# Altium schematic sheet 1_P1.schdoc
size 429 x 307 mm; Symbol: Sheet-Symbol_B; Device: Sheet-Symbol_B; @Project Name: INS Nav0; @Page Count: 1; @Update Date: 2026-06-21; @Create Date: 2026-06-21; @Schematic Name: Schematic1; @Page No: 1; @Page Name: P1; Company: EasyEDA.com; Version: V1.0; Page Size: B; @Create Time: 07:02:29; @Update Time: 11:43:39; @Board Name: Board1; Width: 1655; Height: 1170; Region Start: 1; X Region Count: 6; Y Region Count: 4; Blade Width: 10; Color: #000066; Title Block Position: 3
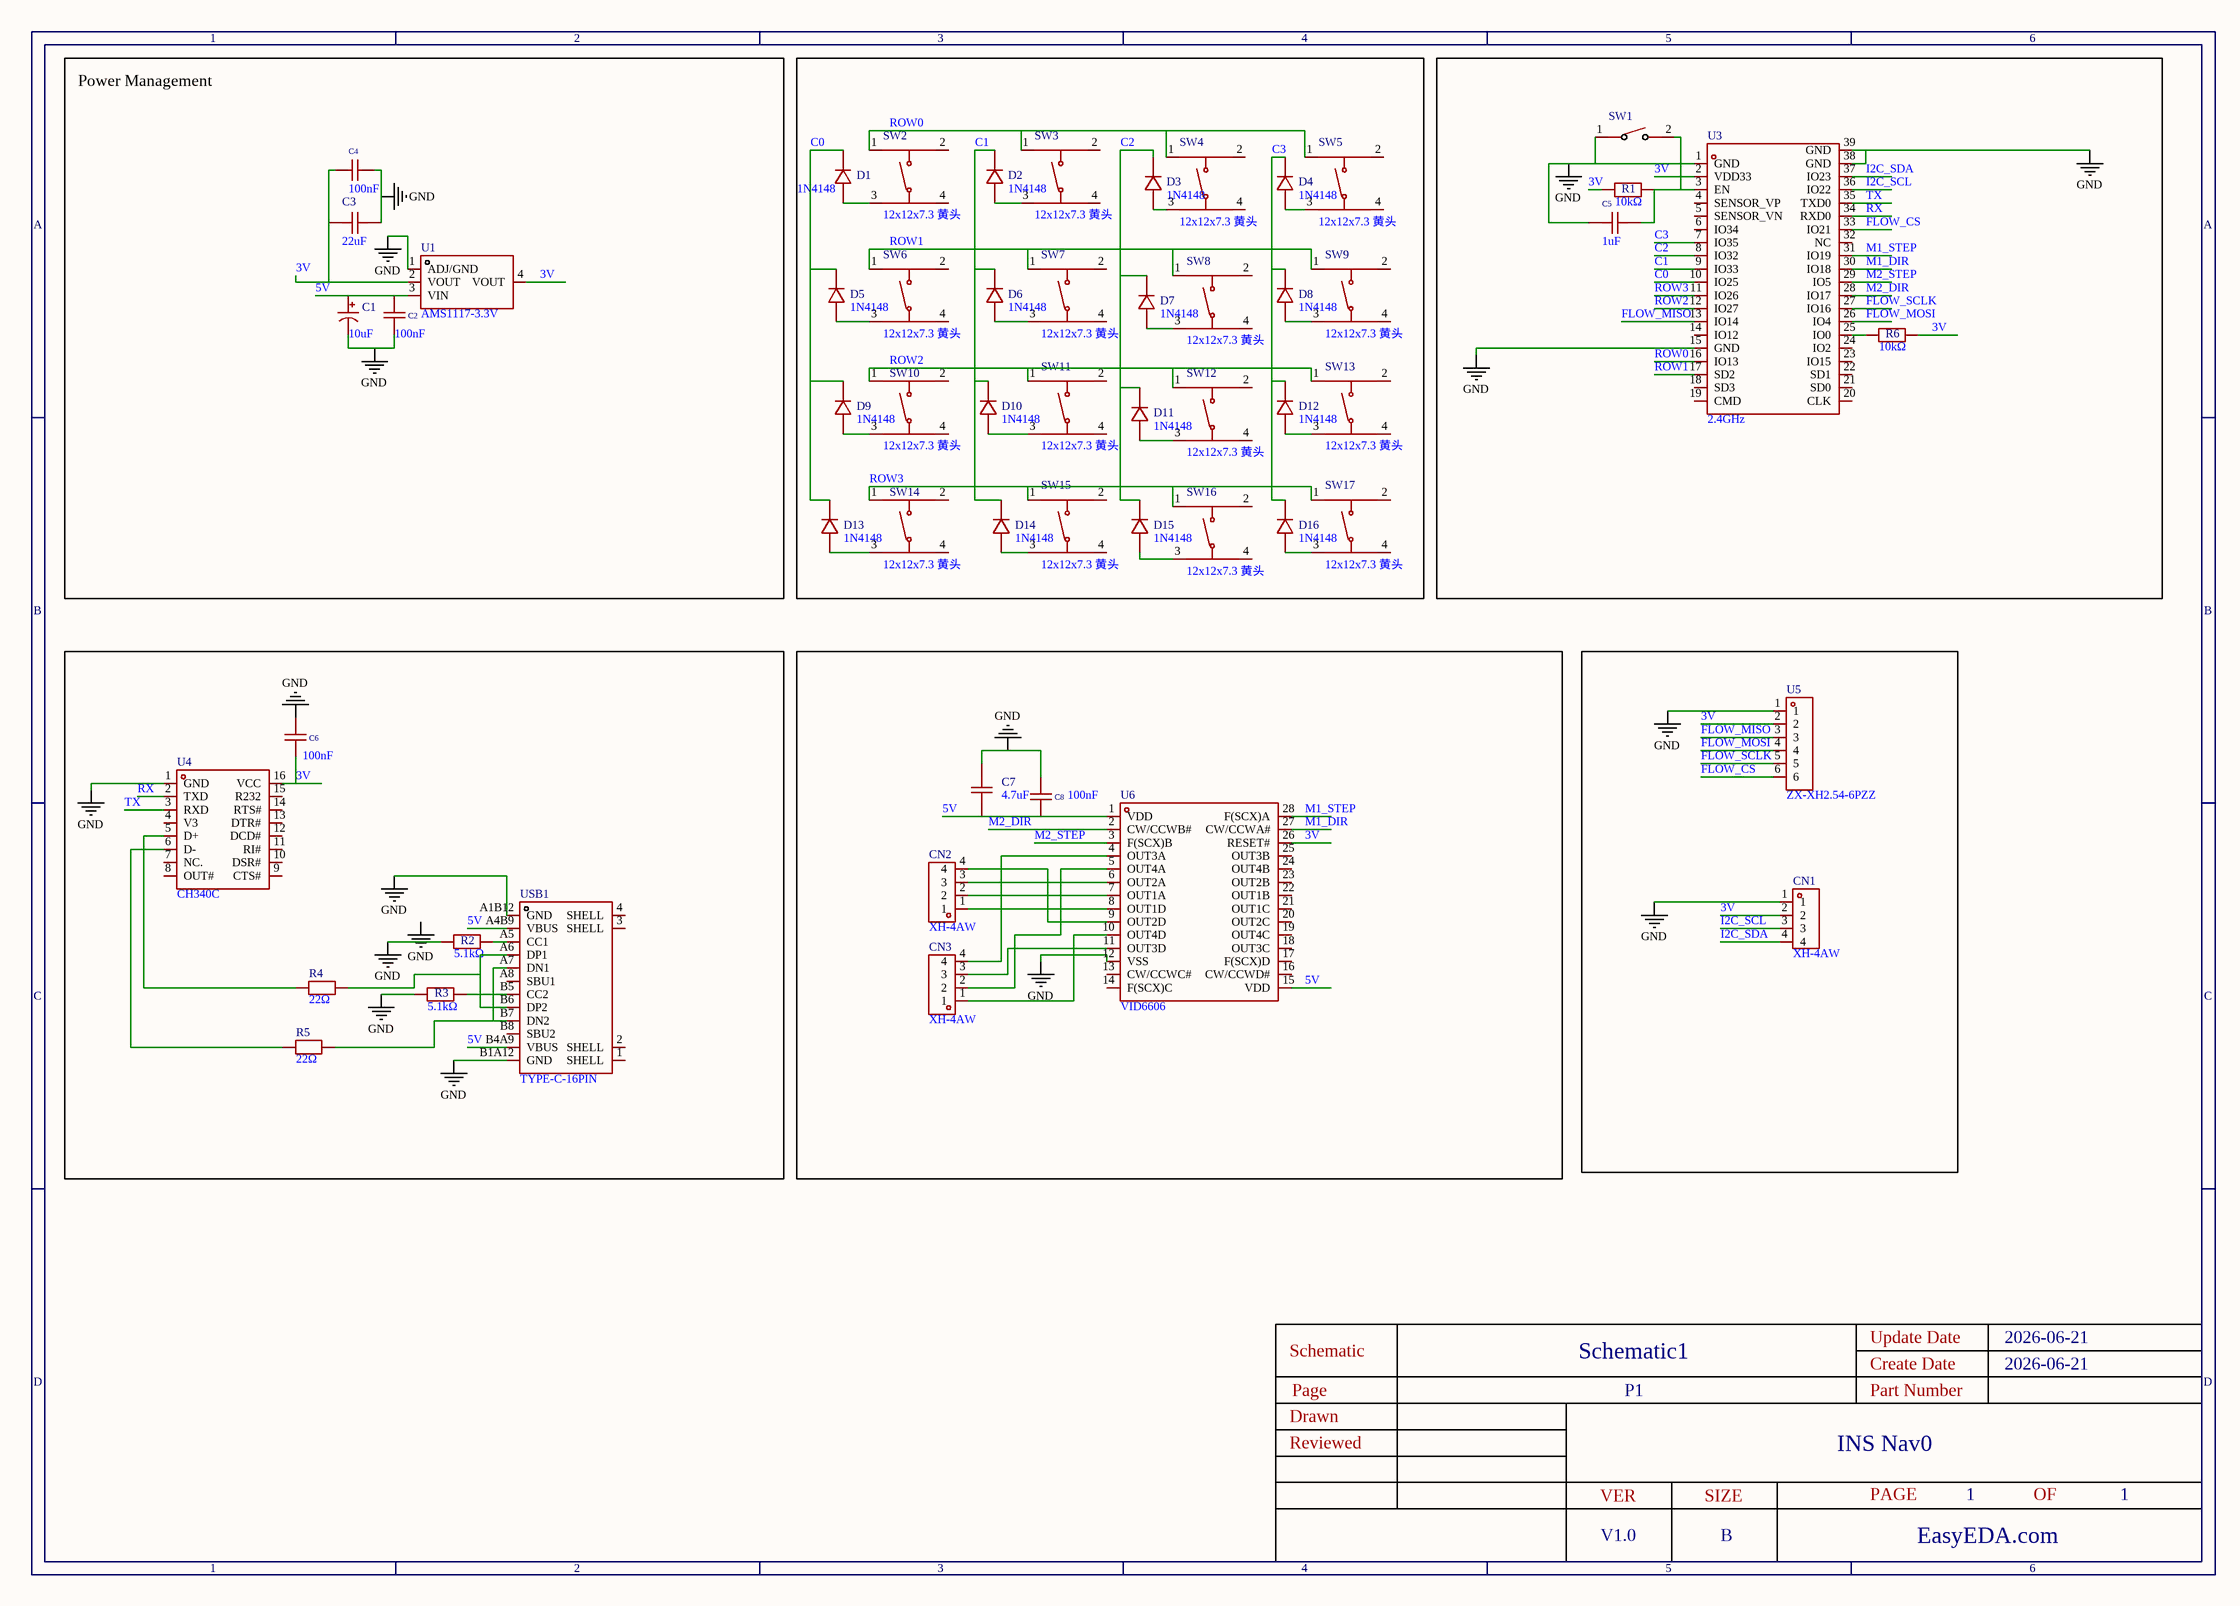
[diagram p0: 1_P1.schdoc]

## Parts
C1  10uF  [CAP-TH_BD4.0-P1.50-D0.8-FD]
C2  100nF  [C0402]
C3  22uF  [C0603]
C4  100nF  [C0402]
C5  1uF  [C0603]
C6  100nF  [C0402]
C7  4.7uF  [C0402]
C8  100nF  [C0402]
CN1  XH-4AW  [CONN-TH_XH-4AW]
CN2  XH-4AW  [CONN-TH_XH-4AW]
CN3  XH-4AW  [CONN-TH_XH-4AW]
D1  1N4148  [DO-35_BD2.0-L4.0-P8.00-D0.5-FD]
D2  1N4148  [DO-35_BD2.0-L4.0-P8.00-D0.5-FD]
D3  1N4148  [DO-35_BD2.0-L4.0-P8.00-D0.5-FD]
D4  1N4148  [DO-35_BD2.0-L4.0-P8.00-D0.5-FD]
D5  1N4148  [DO-35_BD2.0-L4.0-P8.00-D0.5-FD]
D6  1N4148  [DO-35_BD2.0-L4.0-P8.00-D0.5-FD]
D7  1N4148  [DO-35_BD2.0-L4.0-P8.00-D0.5-FD]
D8  1N4148  [DO-35_BD2.0-L4.0-P8.00-D0.5-FD]
D9  1N4148  [DO-35_BD2.0-L4.0-P8.00-D0.5-FD]
D10  1N4148  [DO-35_BD2.0-L4.0-P8.00-D0.5-FD]
D11  1N4148  [DO-35_BD2.0-L4.0-P8.00-D0.5-FD]
D12  1N4148  [DO-35_BD2.0-L4.0-P8.00-D0.5-FD]
D13  1N4148  [DO-35_BD2.0-L4.0-P8.00-D0.5-FD]
D14  1N4148  [DO-35_BD2.0-L4.0-P8.00-D0.5-FD]
D15  1N4148  [DO-35_BD2.0-L4.0-P8.00-D0.5-FD]
D16  1N4148  [DO-35_BD2.0-L4.0-P8.00-D0.5-FD]
R1  10kΩ  [R0603]
R2  5.1kΩ  [R0603]
R3  5.1kΩ  [R0603]
R4  22Ω  [R0603]
R5  22Ω  [R0603]
R6  10kΩ  [R0603]
SW1  TS-1088-AR02016  [SW-SMD_L3.9-W3.0-P4.45]  (value not drawn)
SW2  12x12x7.3 黄头  [SW-TH_4P-L12.0-W12.0-P5.00-LS12.5]
SW3  12x12x7.3 黄头  [SW-TH_4P-L12.0-W12.0-P5.00-LS12.5]
SW4  12x12x7.3 黄头  [SW-TH_4P-L12.0-W12.0-P5.00-LS12.5]
SW5  12x12x7.3 黄头  [SW-TH_4P-L12.0-W12.0-P5.00-LS12.5]
SW6  12x12x7.3 黄头  [SW-TH_4P-L12.0-W12.0-P5.00-LS12.5]
SW7  12x12x7.3 黄头  [SW-TH_4P-L12.0-W12.0-P5.00-LS12.5]
SW8  12x12x7.3 黄头  [SW-TH_4P-L12.0-W12.0-P5.00-LS12.5]
SW9  12x12x7.3 黄头  [SW-TH_4P-L12.0-W12.0-P5.00-LS12.5]
SW10  12x12x7.3 黄头  [SW-TH_4P-L12.0-W12.0-P5.00-LS12.5]
SW11  12x12x7.3 黄头  [SW-TH_4P-L12.0-W12.0-P5.00-LS12.5]
SW12  12x12x7.3 黄头  [SW-TH_4P-L12.0-W12.0-P5.00-LS12.5]
SW13  12x12x7.3 黄头  [SW-TH_4P-L12.0-W12.0-P5.00-LS12.5]
SW14  12x12x7.3 黄头  [SW-TH_4P-L12.0-W12.0-P5.00-LS12.5]
SW15  12x12x7.3 黄头  [SW-TH_4P-L12.0-W12.0-P5.00-LS12.5]
SW16  12x12x7.3 黄头  [SW-TH_4P-L12.0-W12.0-P5.00-LS12.5]
SW17  12x12x7.3 黄头  [SW-TH_4P-L12.0-W12.0-P5.00-LS12.5]
U1  AMS1117-3.3V  [SOT-223-4_L6.5-W3.5-P2.30-LS7.0-BR]
U3  2.4GHz  [WIFIM-SMD_39P-L25.5-W18.0-P1.27]
U4  CH340C  [SOP-16_L10.0-W3.9-P1.27-LS6.0-BL]
U5  ZX-XH2.54-6PZZ  [CONN-TH_6P-P2.50_ZX-XH2.54-6PZZ]
U6  VID6606  [SOP-28_L18.1-W7.6-P1.27-LS10.3-BL]
USB1  TYPE-C-16PIN  [USB-C-SMD_TYPE-C16PIN-SHOUHAN]

## Blocks framed on the sheet
Power Management: C1-C4 U1

## Nets
GND: C1.2 C2.1 C3.2 C4.2 C5.1 C6.2 C7.2 C8.2 CN1.1 R2.1 R3.1 SW1.1 U1.1(ADJ/GND) U3.1(GND) U3.15(GND) U3.38(GND) U3.39(GND) U4.1(GND) U5.1 U6.12(VSS) USB1.A1B12(GND) USB1.B1A12(GND)
3V: C3.1 C4.1 C6.1 CN1.2 R1.2 R6.1 U1.2(VOUT) U1.4(VOUT) U3.2(VDD33) U4.16(VCC) U5.2 U6.26(RESET#)
5V: C1.1 C2.2 C7.1 C8.1 U1.3(VIN) U6.1(VDD) U6.15(VDD) USB1.A4B9(VBUS) USB1.B4A9(VBUS)
C0: D1.2(K) D5.2(K) D9.2(K) D13.2(K) U3.10(IO25)
C1: D2.2(K) D6.2(K) D10.2(K) D14.2(K) U3.9(IO33)
C2: D3.2(K) D7.2(K) D11.2(K) D15.2(K) U3.8(IO32)
C3: D4.2(K) D8.2(K) D12.2(K) D16.2(K) U3.7(IO35)
FLOW_CS: U3.33(IO21) U5.6
FLOW_MISO: U3.13(IO14) U5.3
FLOW_MOSI: U3.26(IO4) U5.4
FLOW_SCLK: U3.27(IO16) U5.5
I2C_SCL: CN1.3 U3.36(IO22)
I2C_SDA: CN1.4 U3.37(IO23)
M1_DIR: U3.30(IO18) U6.27(CW/CCWA#)
M1_STEP: U3.31(IO19) U6.28(F(SCX)A)
M2_DIR: U3.28(IO17) U6.2(CW/CCWB#)
M2_STEP: U3.29(IO5) U6.3(F(SCX)B)
ROW0: SW2.1 SW3.1 SW4.1 SW5.1 U3.16(IO13)
ROW1: SW6.1 SW7.1 SW8.1 SW9.1 U3.17(SD2)
ROW2: SW10.1 SW11.1 SW12.1 SW13.1 U3.12(IO27)
ROW3: SW14.1 SW15.1 SW16.1 SW17.1 U3.11(IO26)
RX: U3.34(RXD0) U4.2(TXD)
TX: U3.35(TXD0) U4.3(RXD)
NetC5_2: C5.2 R1.1 SW1.2 U3.3(EN)
NetCN2_1: CN2.1 U6.8(OUT1D)
NetCN2_2: CN2.2 U6.7(OUT1A)
NetCN2_3: CN2.3 U6.6(OUT2A)
NetCN2_4: CN2.4 U6.9(OUT2D)
NetCN3_1: CN3.1 U6.10(OUT4D)
NetCN3_2: CN3.2 U6.5(OUT4A)
NetCN3_3: CN3.3 U6.11(OUT3D)
NetCN3_4: CN3.4 U6.4(OUT3A)
NetD1_1: D1.1(A) SW2.3
NetD2_1: D2.1(A) SW3.3
NetD3_1: D3.1(A) SW4.3
NetD4_1: D4.1(A) SW5.3
NetD5_1: D5.1(A) SW6.3
NetD6_1: D6.1(A) SW7.3
NetD7_1: D7.1(A) SW8.3
NetD8_1: D8.1(A) SW9.3
NetD9_1: D9.1(A) SW10.3
NetD10_1: D10.1(A) SW11.3
NetD11_1: D11.1(A) SW12.3
NetD12_1: D12.1(A) SW13.3
NetD13_1: D13.1(A) SW14.3
NetD14_1: D14.1(A) SW15.3
NetD15_1: D15.1(A) SW16.3
NetD16_1: D16.1(A) SW17.3
NetR2_2: R2.2 USB1.A5(CC1)
NetR3_2: R3.2 USB1.B5(CC2)
NetR4_1: R4.1 U4.5(D+)
NetR4_2: R4.2 USB1.A6(DP1) USB1.B6(DP2)
NetR5_1: R5.1 U4.6(D-)
NetR5_2: R5.2 USB1.A7(DN1) USB1.B7(DN2)
NetR6_2: R6.2 U3.25(IO0)

Not connected (* = marked no-connect by the designer): SW2 2 4; SW3 2 4; SW4 2 4; SW5 2 4; SW6 2 4; SW7 2 4; SW8 2 4; SW9 2 4; SW10 2 4; SW11 2 4; SW12 2 4; SW13 2 4; SW14 2 4; SW15 2 4; SW16 2 4; SW17 2 4; U3 4(SENSOR_VP) 5(SENSOR_VN) 6(IO34) 14(IO12) 18(SD3) 19(CMD) 20(CLK) 21(SD0) 22(SD1) 23(IO15) 24(IO2) 32(NC); U4 4(V3) 7(NC.) 8(OUT#) 9(CTS#) 10(DSR#) 11(RI#) 12(DCD#) 13(DTR#) 14(RTS#) 15(R232); U6 13(CW/CCWC#) 14(F(SCX)C) 16(CW/CCWD#) 17(F(SCX)D) 18(OUT3C) 19(OUT4C) 20(OUT2C) 21(OUT1C) 22(OUT1B) 23(OUT2B) 24(OUT4B) 25(OUT3B); USB1 1(SHELL) 2(SHELL) 3(SHELL) 4(SHELL) A8(SBU1) B8(SBU2)

## Notes on the sheet
- Labels drawn without touching a wire or pin: GND
- 1
- 2
- 3
- 4
- 5
- 6
- A
- B
- C
- Schematic
- Schematic1
- Create Date
- Update Date
- 2026-06-21
- D
- Drawn
- Page
- P1
- Part Number
- Reviewed
- VER
- SIZE
- PAGE
- INS Nav0
- OF
- V1.0
- EasyEDA.com

## Library data of the parts
C1 = KF106M025C05RR0VH2FP0: Manufacturer: Chengx(承兴); Symbol: 10uF 25V 4*5; Add into BOM: yes; Tolerance: ±20%; Voltage Rating: 25V; Ripple Current: 20mA@120Hz; Pin Spacing: 1.5mm; Lifetime: 1000hrs@105℃; Device: KF106M025C05RR0VH2FP0; LCSC Part Name: 10uF ±20% 25V; Supplier Part: C43846; Manufacturer Part: KF106M025C05RR0VH2FP0; Supplier Footprint: 插件,D4xL5mm; JLCPCB Part Class: Extended Part; Datasheet: https://item.szlcsc.com/datasheet/KF106M025C05RR0VH2FP0/44848.html; Supplier: LCSC; Convert to PCB: yes; Value: 10uF; Equivalent Series Resistance(ESR): -; Diameter: 4mm; Height - Seated (Max): 5mm; Operating Temperature: -40℃~+105℃
C2 C4 C6 C8 = CC0402KRX5R9BB104: Manufacturer: YAGEO(国巨); Add into BOM: yes; Tolerance: ±10%; Voltage Rating: 50V; Temperature Coefficient: X5R; Symbol: CC0402KRX5R9BB104; Device: CC0402KRX5R9BB104; Supplier: LCSC; Manufacturer Part: CC0402KRX5R9BB104; Value: 100nF; Supplier Part: C105882; JLCPCB Part Class: Extended Part; LCSC Part Name: 100nF ±10% 50V; Supplier Footprint: 0402; Datasheet: https://item.szlcsc.com/datasheet/CC0402KRX5R9BB104/107097.html; Convert to PCB: yes
C3 = FCC0603X226M100CT: Manufacturer: FOJAN(富捷); Add into BOM: yes; Tolerance: ±20%; Voltage Rating: 10V; Temperature Coefficient: X5R; Symbol: FCC0603X226M100CT; Device: FCC0603X226M100CT; LCSC Part Name: 22uF ±20% 10V; Supplier Part: C46635921; Manufacturer Part: FCC0603X226M100CT; Supplier Footprint: 0603; JLCPCB Part Class: Extended Part; Datasheet: https://item.szlcsc.com/datasheet/FCC0603X226M100CT/48791854.html; Supplier: LCSC; Convert to PCB: yes; Value: 22uF
C5 = CC0603JRX7R7BB105: Manufacturer: YAGEO(国巨); Add into BOM: yes; Tolerance: ±5%; Symbol: CC0603JRX7R7BB105; Device: CC0603JRX7R7BB105; Supplier: LCSC; Supplier Part: C519560; Manufacturer Part: CC0603JRX7R7BB105; Value: 1uF; JLCPCB Part Class: Extended Part; LCSC Part Name: 1uF ±5% 16V; Supplier Footprint: 0603; Datasheet: https://atta.szlcsc.com/upload/public/pdf/source/20200423/C519560_04055A817EC1D690632F33783E937415.pdf; Convert to PCB: yes
C7 = HGC0402R5475M100NTEJ: Manufacturer: Chinocera(华瓷); Add into BOM: yes; Tolerance: ±20%; Voltage Rating: 10V; Temperature Coefficient: X5R; Symbol: HGC0402R5475M100NTEJ; Device: HGC0402R5475M100NTEJ; LCSC Part Name: 4.7uF ±20% 10V; Supplier Part: C7472957; Manufacturer Part: HGC0402R5475M100NTEJ; Supplier Footprint: 0402; JLCPCB Part Class: Extended Part; Datasheet: https://item.szlcsc.com/datasheet/HGC0402R5475M100NTEJ/8532804.html; Supplier: LCSC; Convert to PCB: yes; Value: 4.7uF
CN1-CN3 = XH-4AW_C2908613: Manufacturer: HCTL(华灿天禄); Add into BOM: yes; Pins Structure: 1x4P; Pitch: 2.54mm; Reference Series: XH; Number of PINs Per Row: 4; Current Rating: 3A; Voltage Rating: 250V; Plastic Material: PA66; Flame Retardant Rating: UL94V-0; Z-Height of the Board: 5.9mm; Y-Width of Bottom Edge on Board: 7mm; Symbol: XH-4AW_C2908613; Device: XH-4AW_C2908613; LCSC Part Name: 1x4P 间距:2.54mm 弯插 系列:XH; Supplier Part: C2908613; Manufacturer Part: XH-4AW; Supplier Footprint: 弯插,P=2.5mm; JLCPCB Part Class: Extended Part; Datasheet: https://item.szlcsc.com/datasheet/XH-4AW/3184384.html; Supplier: LCSC; Convert to PCB: yes; Mounting Type: Right Angle; Number of Pins: 4P; Number of Rows: 1; Row Spacing: -; Contact Material: Brass; Contact Plating: Tin; Operating Temperature: -25℃~+85℃
D1-D16 = 1N4148_C258182: Manufacturer: onsemi(安森美); Add into BOM: yes; Diode Configuration: 1 Independent; Pd - Power Dissipation: 500mW; Current - Rectified: 200mA; Voltage - DC Reverse(Vr): 100V; Voltage - Forward(Vf@If): 1V@10mA; Non-Repetitive Peak Forward Surge Current: 4A; Reverse Leakage Current (Ir): 5uA@75V; Reverse Recovery Time (trr): 4ns; Operating Junction Temperature Range: -55℃~+175℃@(Tj); Symbol: 1N4148_C258182; Device: 1N4148_C258182; LCSC Part Name: 100V 200mA; Supplier Part: C258182; Manufacturer Part: 1N4148; Supplier Footprint: DO-35; JLCPCB Part Class: Extended Part; Datasheet: https://item.szlcsc.com/datasheet/1N4148/251208.html; Supplier: LCSC; Convert to PCB: yes
R1 R6 = FRC0603J103 TS: Manufacturer: FOJAN(富捷); Add into BOM: yes; Tolerance: ±5%; Power(Watts): 100mW; Voltage-Supply(Max): 75V; Temperature Coefficient: ±100ppm/℃; Symbol: FRC0603J103TS; Device: FRC0603J103 TS; LCSC Part Name: 10kΩ ±5% 100mW 厚膜电阻; Supplier Part: C2930027; Manufacturer Part: FRC0603J103 TS; Supplier Footprint: 0603; JLCPCB Part Class: Extended Part; Datasheet: https://item.szlcsc.com/datasheet/FRC0603J103%2520TS/3266960.html; Supplier: LCSC; Convert to PCB: yes; Type: Thick Film Resistor; Value: 10kΩ; Operating Temperature: -55℃~+155℃
R2 R3 = FRC0603F5101TS: Manufacturer: FOJAN(富捷); Add into BOM: yes; Tolerance: ±1%; Power(Watts): 100mW; Voltage-Supply(Max): 75V; Temperature Coefficient: ±100ppm/℃; Symbol: FRC0603F5101TS; Device: FRC0603F5101TS; LCSC Part Name: 5.1kΩ ±1% 100mW 厚膜电阻; Supplier Part: C2907044; Manufacturer Part: FRC0603F5101TS; Supplier Footprint: 0603; JLCPCB Part Class: Extended Part; Supplier: LCSC; Convert to PCB: yes; Type: Thick Film Resistor; Value: 5.1kΩ; Operating Temperature: -55℃~+155℃
R4 R5 = FRC0603J220 TS: Manufacturer: FOJAN(富捷); Add into BOM: yes; Tolerance: ±5%; Power(Watts): 100mW; Voltage-Supply(Max): 75V; Temperature Coefficient: ±100ppm/℃; Symbol: FRC0603J220 TS; Device: FRC0603J220 TS; LCSC Part Name: 22Ω ±5% 100mW 厚膜电阻; Supplier Part: C2907129; Manufacturer Part: FRC0603J220 TS; Supplier Footprint: 0603; JLCPCB Part Class: Extended Part; Supplier: LCSC; Convert to PCB: yes; Type: Thick Film Resistor; Value: 22Ω; Operating Temperature: -55℃~+155℃
SW1 = TS-1088-AR02016: Manufacturer: XUNPU(讯普); Add into BOM: yes; Circuit: SPST; Actuator Style: Round Button; Operating Force: 1.6N; Switch Height: 2mm; with Bracket: Without Bracket; Contact Current: 50mA; Voltage Rating: 12V; Actuator/Cap Color: Black; Life: 100,000 Cycles; Symbol: TS-1088-AR02016; Device: TS-1088-AR02016; LCSC Part Name: 4*3*2mm 立贴 轻触开关; Supplier Part: C720477; Manufacturer Part: TS-1088-AR02016; Supplier Footprint: SMD,4x3mm; JLCPCB Part Class: Basic Part; Datasheet: https://item.szlcsc.com/datasheet/TS-1088-AR02016/763484.html; Supplier: LCSC; Convert to PCB: yes; Mounting Type: Surface Mount,Vertical; Length: 4mm; Width: 3mm; Termination Style: SMD(SMT) Tab; Operating Temperature: -30℃~+80℃
SW2-SW17 = 12x12x7.3 黄头: Manufacturer: BOOMELE(博穆精密); Add into BOM: yes; Circuit: SPST; Actuator Style: Rectangular Button; Switch Height: 7.3mm; Contact Current: 50mA; Voltage Rating: 12V; Symbol: 12X12X7.3; Device: 12x12x7.3 黄头; LCSC Part Name: 12*12*7.3mm 直插 轻触开关; Supplier Part: C10861; Manufacturer Part: 12x12x7.3 黄头; Supplier Footprint: 插件; JLCPCB Part Class: Extended Part; Datasheet: https://item.szlcsc.com/datasheet/12x12x7.3%2520%25E9%25BB%2584%25E5%25A4%25B4/11408.html; Supplier: LCSC; Convert to PCB: yes; Mounting Type: Through Hole; Length: 12mm; Width: 12mm; With Lamp: -; Life: -
U1 = AMS1117-3.3V_C2688239: Manufacturer: WPMtek(维攀); Add into BOM: yes; Output Configuration: Positive; Voltage - Supply: 12V; Output Voltage: 3.3V; Output Current: 1A; Power Supply Rejection Ratio (PSRR): 70dB@(120Hz); Voltage Dropout: 1.4V@(1A); standby current: 5mA; Noise: 0.003%Vout; Output Type: Fixed; Number of Outputs: 1; Symbol: AMS1117-3.3V; Device: AMS1117-3.3V_C2688239; LCSC Part Name: 3.3V 1A 12V; Supplier Part: C2688239; Manufacturer Part: AMS1117-3.3V; Supplier Footprint: SOT-223-3L; JLCPCB Part Class: Extended Part; Datasheet: https://item.szlcsc.com/datasheet/AMS1117-3.3V/2793377.html; Supplier: LCSC; Convert to PCB: yes; Features: -; Operating Temperature: -40℃~+125℃@(Tj)
U3 = ESP32-WROOM-32-N8: Manufacturer: ESPRESSIF(乐鑫); Utilized IC / Part: ESP32-DOWDQ6; Symbol: ESP32-WROOM-32(8MB); Add into BOM: yes; Wireless Standard: Bluetooth4.2; Interface Type: I2C；GPIO；SPI；SDIO；ADC；UART; Output Power: 20.5dBm; Voltage - Supply: 2.7V~3.6V; Sensitivity: -98dBm; Device: ESP32-WROOM-32-N8; LCSC Part Name: 不带固件 ESP32-WROOM-32-N8 停产; Supplier Part: C529582; Manufacturer Part: ESP32-WROOM-32-N8; Supplier Footprint: SMD,25.5x18mm; JLCPCB Part Class: Extended Part; Datasheet: https://item.szlcsc.com/datasheet/ESP32-WROOM-32-N8/549848.html; Supplier: LCSC; Convert to PCB: yes; Value: 2.4GHz; Operating Temperature: -40℃~+85℃; Features: Integrated Bluetooth function；Over-the-air (OTA) update
U4 = CH340C: Manufacturer: WCH(南京沁恒); Add into BOM: yes; Applications Function: Transceiver; USB Protocol: USB 2.0; Voltage - Supply: 3.3V；5V; Data Rate: 2Mbps; Current - Supply: 7mA; Supply Current (Iq): 50uA; Symbol: CH340C; Device: CH340C; LCSC Part Name: USB转串口芯片; Supplier Part: C84681; Manufacturer Part: CH340C; Supplier Footprint: SOP-16; JLCPCB Part Class: Extended Part; Datasheet: https://item.szlcsc.com/datasheet/CH340C/85852.html; Supplier: LCSC; Convert to PCB: yes; Operating Temperature: -20℃~+70℃
U5 = ZX-XH2.54-6PZZ: Manufacturer: Megastar(兆星); Add into BOM: yes; Pins Structure: 1x6P; Pitch: 2.5mm; Reference Series: XH; Number of PINs Per Row: 6; Current Rating: 3A; Voltage Rating: 250V; Plastic Material: PA66; Flame Retardant Rating: UL94V-0; Z-Height of the Board: 7mm; X-Length of Bottom Edge on Board (Spacing Line): 17.5mm; Y-Width of Bottom Edge on Board: 5.9mm; Symbol: ZX-XH2.54-6PZZ; Device: ZX-XH2.54-6PZZ; LCSC Part Name: 1x6P 间距:2.5mm 直插 系列:XH; Supplier Part: C7429636; Manufacturer Part: ZX-XH2.54-6PZZ; Supplier Footprint: 插件,P=2.5mm; JLCPCB Part Class: Extended Part; Datasheet: https://item.szlcsc.com/datasheet/ZX-XH2.54-6PZZ/8427553.html; Supplier: LCSC; Convert to PCB: yes; Mounting Type: Through Hole; Number of Pins: 6P; Number of Rows: 1; Row Spacing: -; Contact Material: Brass; Contact Plating: Tin; Operating Temperature: -25℃~+85℃; Supplementary Features: -; Color: White
U6 = VID6606: Add into BOM: yes; Symbol: VID6606; Device: VID6606; LCSC Part Name: VID6606; Supplier Part: C9900075938; Manufacturer Part: VID6606; Supplier Footprint: SOP-28; JLCPCB Part Class: Extended Part; Supplier: LCSC; Convert to PCB: yes
USB1 = TYPE-C-16PIN_C53207801: Manufacturer: JXTCONN(聚兴泰); Add into BOM: yes; Connector Type: Type-C; Gender: Female; Number of Contacts: 16P; Number of Ports: 1; Current Rating-Power: 3A; Voltage Rating: 20V; Connect-Disconnect Life: 10000 times; Detection color: Black; Symbol: TYPE-C-16PIN_C53207801; Device: TYPE-C-16PIN_C53207801; LCSC Part Name: Type-C 母 卧贴; Supplier Part: C53207801; Manufacturer Part: TYPE-C-16PIN; Supplier Footprint: SMD; JLCPCB Part Class: Extended Part; Datasheet: https://item.szlcsc.com/datasheet/TYPE-C-16PIN/56243866.html; Supplier: LCSC; Convert to PCB: yes; Protocol Standard: -; Mounting Type: Surface Mount, Right Angle; Length: 7.35mm; Operating Temperature: -40℃~+85℃